# EAGLE design board (EAGLE 8.5.2)
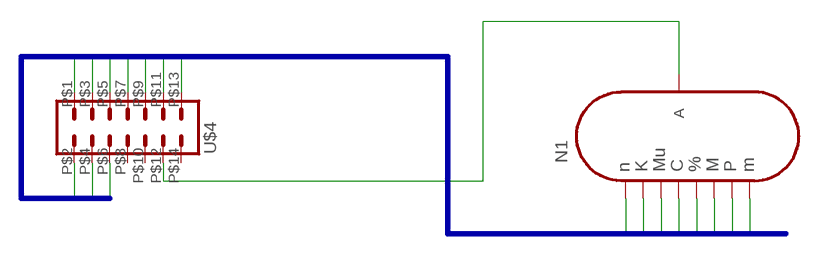
[diagram p0: schematic, sheet 1]

## Parts
N1  IN-19A  [IN-19]
U$4  PIN_HEADER_MALE_2X07_14P  [PIN_HEADER_MALE_2X07_14P]

## Nets
N$1: N1.8(A) U$4.P$12
NIXIE0: U$4.P$1
NIXIE1: N1.11 U$4.P$3
NIXIE2: N1.10 U$4.P$5
NIXIE3: N1.12 U$4.P$7
NIXIE4: N1.14 U$4.P$9
NIXIE5: N1.2 U$4.P$11
NIXIE6: N1.4 U$4.P$13
NIXIE7: N1.5 U$4.P$2
NIXIE8: N1.6 U$4.P$4
NIXIE9: U$4.P$6
Unconnected: U$4.P$8 U$4.P$10 U$4.P$14

## Buses
NIXIE[0..9]

## Library data of the parts
N1 = russian-nixies:IN-19A: IN-19A: medium symbol frontview nixie tube
U$4 = 160713 Library by matsu:PIN_HEADER_MALE_2X07_14P

## Net classes
0 default: width 0.508 mm, clearance 0.254 mm

## Board
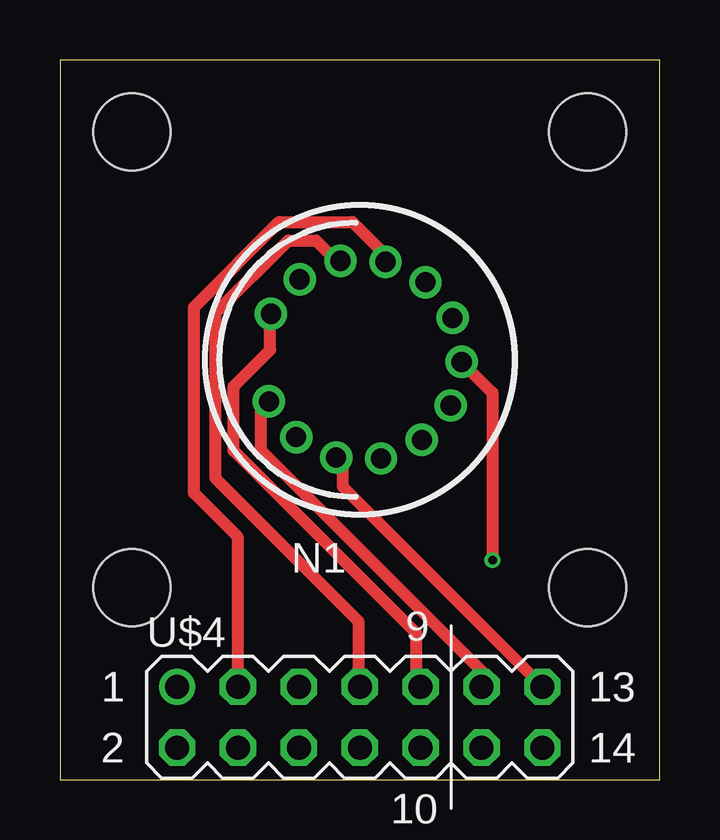
[diagram p1: board, top side]
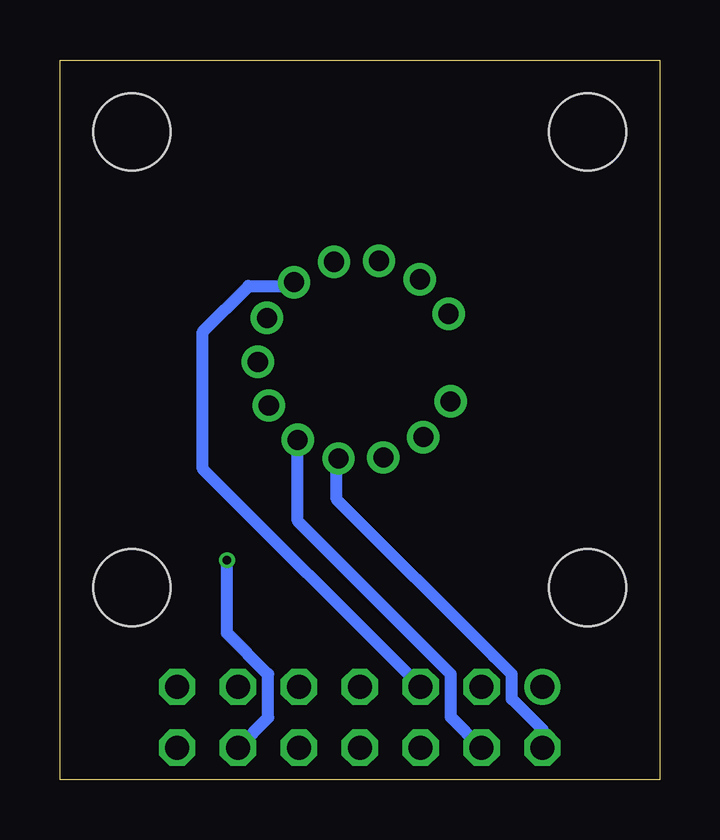
[diagram p2: board, bottom side, seen from below]

Size 25 x 30 mm. Coordinates in mm from the lower left corner, seen from the top.
Outline: 0,0 25,0 25,30 0,30 0,0
Copper layers (1*16): Top 0.035mm / dielectric 1.5mm / Bottom 0.035mm
Design rules "Elecrow_2-layer_eagle_rule": minimum track width 6mil, minimum drill 12mil, track to track 6mil, track to pad 6mil, pad to pad 6mil, via to via 6mil, smd to smd 0mil, copper to edge 10mil, drill to drill 10mil, minimum pad ring 10mil, minimum via ring 6mil, stop-mask expansion 2mil, vias tented up to drill 100mil, thermal gap 10mil
Holes 3.2 mm at 3,27 22,27 22,8 3,8

### Footprints (pad centres in the part's own frame; a part is rotated, then mirrored left to right if it is on the bottom)
IN-19 = drill 0.84: 2 1.733,-3.786; 3 3.222,-2.652; 4 4.072,-0.985; 5 4.114,0.886; 6 3.34,2.59; 7 1.903,3.79; 8 0.089,4.247; 9 -1.745,3.872; 10 -3.234,2.738; 11 -4.084,1.07; 12 -4.126,-0.801; 13 -3.352,-2.505; 14 -1.915,-3.704
PIN_HEADER_MALE_2X07_14P = drill 1: P$1 -7.62,1.27 | drill 1 octagon: P$2 -7.62,-1.27; P$3 -5.08,1.27; P$4 -5.08,-1.27; P$5 -2.54,1.27; P$6 -2.54,-1.27; P$7 0,1.27; P$8 0,-1.27; P$9 2.54,1.27; P$10 2.54,-1.27; P$11 5.08,1.27; P$12 5.08,-1.27; P$13 7.62,1.27; P$14 7.62,-1.27

### Placement (x,y rotation side)
N1  12.5,17.5 270 top
U$4  12.5,2.6 0 top

### Tracks (layer width: path | path; a pad name or v marks a point on that pad's centre or on a via)
N$1  (via drill 0.35)
  Top 0.508: N1.8 18.03,16.12 v18.03,9.14
  Bottom 0.508: U$4.P$12 16.32,2.59 16.32,4.39 18.03,6.11 v18.03,9.14
NIXIE1
  Top 0.508: N1.11 13.34,21.72 13.34,22.1 12.19,23.24 9.14,23.24 5.59,19.68 5.59,11.94 7.42,10.11 U$4.P$3
NIXIE2
  Bottom 0.508: N1.10 15.24,20.57 17.14,20.57 19.05,18.67 19.05,12.95 10.29,4.19 U$4.P$5
NIXIE3
  Top 0.508: N1.12 11.43,21.72 10.67,22.48 9.53,22.48 6.48,19.43 6.48,12.57 12.45,6.6 12.45,3.92 U$4.P$7 12.19,4.19
NIXIE4
  Top 0.508: N1.14 8.76,19.05 8.76,17.91 7.24,16.38 7.24,13.72 14.86,6.1 14.86,4.19 U$4.P$9
NIXIE5
  Top 0.508: N1.2 8.38,15.62 8.38,13.72 17.91,4.19 U$4.P$11
NIXIE6
  Top 0.508: N1.4 11.81,13.34 11.81,12.19 19.81,4.19 U$4.P$13
NIXIE7
  Bottom 0.508: U$4.P$2 4.88,2.08 6.16,3.36 6.16,4.39 6.9,5.13 6.91,5.13 13.46,11.68 13.46,13.31 N1.5
NIXIE8
  Bottom 0.508: U$4.P$4 8.7,2.61 8.7,4.39 15.09,10.79 N1.6